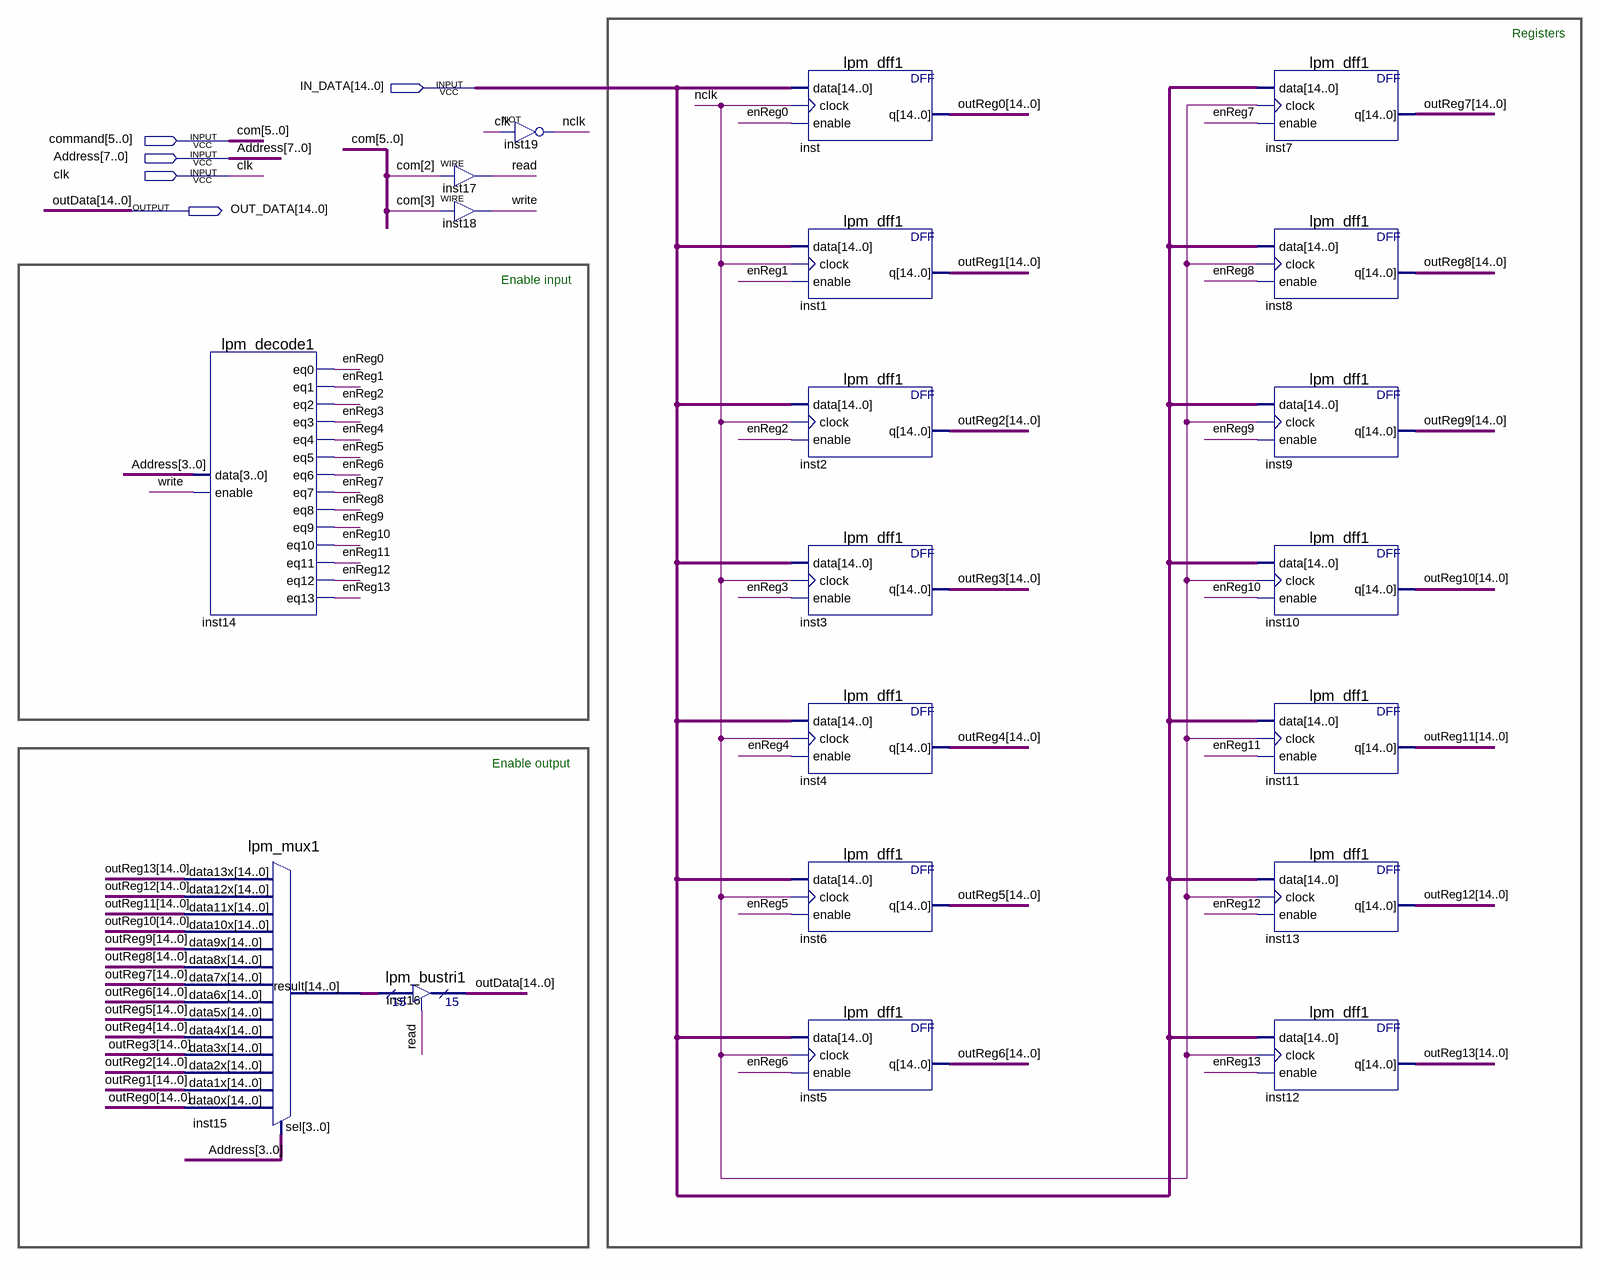
[diagram p0: schematic sheet]
// Quartus schematic registers.bdf as structural Verilog: 20 symbols, 5 pins
module registers (
  input  [14:0] IN_DATA,
  input  [5:0] command,
  input  [7:0] Address,
  input  clk,
  output [14:0] OUT_DATA
);

  wire enReg0, enReg1, enReg2, enReg3, enReg4, enReg5, enReg6, enReg7, enReg8, enReg9, enReg10, enReg11,
       enReg12, enReg13, nclk, read, write;
  wire [14:0] inst15_result, outReg0, outReg1, outReg2, outReg3, outReg4, outReg5, outReg6, outReg7, outReg8,
       outReg9, outReg10, outReg11, outReg12, outReg13;

  lpm_decode1 inst14 (
    .data(Address[3:0]), .enable(write), .eq0(enReg0), .eq1(enReg1), .eq2(enReg2), .eq3(enReg3),
    .eq4(enReg4), .eq5(enReg5), .eq6(enReg6), .eq7(enReg7), .eq8(enReg8), .eq9(enReg9), .eq10(enReg10),
    .eq11(enReg11), .eq12(enReg12), .eq13(enReg13));
  lpm_mux1 inst15 (
    .data13x(outReg13), .data12x(outReg12), .data11x(outReg11), .data10x(outReg10), .data9x(outReg9),
    .data8x(outReg8), .data7x(outReg7), .data6x(outReg6), .data5x(outReg5), .data4x(outReg4),
    .data3x(outReg3), .data2x(outReg2), .data1x(outReg1), .data0x(outReg0), .sel(Address[3:0]),
    .result(inst15_result));
  lpm_bustri1 inst16 (.enabledt(read), .data(inst15_result), .tridata(OUT_DATA));
  assign read = command[2];  // WIRE inst17
  assign write = command[3];  // WIRE inst18
  not inst19 (nclk, clk);
  lpm_dff1 inst (.data(IN_DATA), .clock(nclk), .enable(enReg0), .q(outReg0));
  lpm_dff1 inst1 (.data(IN_DATA), .clock(nclk), .enable(enReg1), .q(outReg1));
  lpm_dff1 inst2 (.data(IN_DATA), .clock(nclk), .enable(enReg2), .q(outReg2));
  lpm_dff1 inst3 (.data(IN_DATA), .clock(nclk), .enable(enReg3), .q(outReg3));
  lpm_dff1 inst4 (.data(IN_DATA), .clock(nclk), .enable(enReg4), .q(outReg4));
  lpm_dff1 inst6 (.data(IN_DATA), .clock(nclk), .enable(enReg5), .q(outReg5));
  lpm_dff1 inst5 (.data(IN_DATA), .clock(nclk), .enable(enReg6), .q(outReg6));
  lpm_dff1 inst7 (.data(IN_DATA), .clock(nclk), .enable(enReg7), .q(outReg7));
  lpm_dff1 inst8 (.data(IN_DATA), .clock(nclk), .enable(enReg8), .q(outReg8));
  lpm_dff1 inst9 (.data(IN_DATA), .clock(nclk), .enable(enReg9), .q(outReg9));
  lpm_dff1 inst10 (.data(IN_DATA), .clock(nclk), .enable(enReg10), .q(outReg10));
  lpm_dff1 inst11 (.data(IN_DATA), .clock(nclk), .enable(enReg11), .q(outReg11));
  lpm_dff1 inst13 (.data(IN_DATA), .clock(nclk), .enable(enReg12), .q(outReg12));
  lpm_dff1 inst12 (.data(IN_DATA), .clock(nclk), .enable(enReg13), .q(outReg13));

  // Other names for the same wires on the sheet: com[5:0] = command; outData[14:0] = OUT_DATA

  // Notes on the sheet:
  //   Registers
  //   Enable input
  //   Enable output
endmodule
